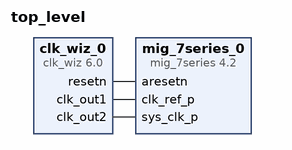
[diagram p0: block diagram of the top level]
# Vivado block design top_level, xc7s50csga324-1, Vivado 2023.1
create_bd_design top_level

create_bd_cell -type ip -vlnv xilinx.com:ip:clk_wiz:6.0 clk_wiz_0
set_property -dict [list \
  CONFIG.CLKOUT1_DRIVES BUFG \
  CONFIG.CLKOUT1_JITTER 436.214 \
  CONFIG.CLKOUT1_PHASE_ERROR 478.666 \
  CONFIG.CLKOUT1_REQUESTED_OUT_FREQ 166.000 \
  CONFIG.CLKOUT2_DRIVES BUFG \
  CONFIG.CLKOUT2_JITTER 423.923 \
  CONFIG.CLKOUT2_PHASE_ERROR 478.666 \
  CONFIG.CLKOUT2_REQUESTED_OUT_FREQ 200.000 \
  CONFIG.CLKOUT2_USED true \
  CONFIG.CLKOUT3_DRIVES BUFG \
  CONFIG.CLKOUT4_DRIVES BUFG \
  CONFIG.CLKOUT5_DRIVES BUFG \
  CONFIG.CLKOUT6_DRIVES BUFG \
  CONFIG.CLKOUT7_DRIVES BUFG \
  CONFIG.FEEDBACK_SOURCE FDBK_AUTO \
  CONFIG.MMCM_BANDWIDTH OPTIMIZED \
  CONFIG.MMCM_CLKFBOUT_MULT_F 42.125 \
  CONFIG.MMCM_CLKOUT0_DIVIDE_F 3.625 \
  CONFIG.MMCM_CLKOUT1_DIVIDE 3 \
  CONFIG.MMCM_COMPENSATION ZHOLD \
  CONFIG.MMCM_DIVCLK_DIVIDE 7 \
  CONFIG.NUM_OUT_CLKS 2 \
  CONFIG.PRIMITIVE MMCM \
  CONFIG.RESET_PORT resetn \
  CONFIG.RESET_TYPE ACTIVE_LOW \
] [get_bd_cells clk_wiz_0]
create_bd_cell -type ip -vlnv xilinx.com:ip:mig_7series:4.2 mig_7series_0
set_property -dict [list \
  CONFIG.BOARD_MIG_PARAM Custom \
  CONFIG.MIG_DONT_TOUCH_PARAM Custom \
  CONFIG.RESET_BOARD_INTERFACE Custom \
  CONFIG.XML_INPUT_FILE mig_a.prj \
] [get_bd_cells mig_7series_0]

# ---- connections ----

connect_bd_net [get_bd_pins clk_wiz_0/resetn] [get_bd_pins mig_7series_0/aresetn]
connect_bd_net [get_bd_pins clk_wiz_0/clk_out1] [get_bd_pins mig_7series_0/clk_ref_p]
connect_bd_net [get_bd_pins clk_wiz_0/clk_out2] [get_bd_pins mig_7series_0/sys_clk_p]

validate_bd_design
save_bd_design
